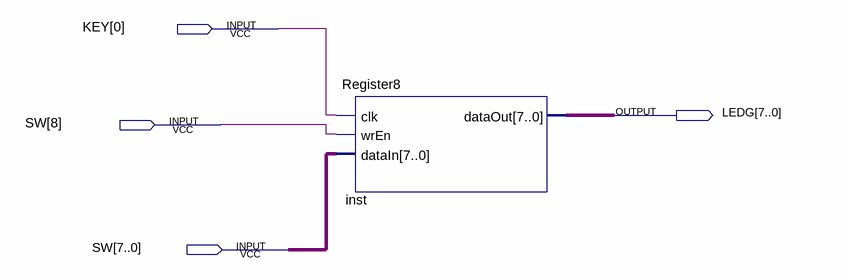
[diagram p0: schematic sheet]
// Quartus schematic Register_Demo.bdf as structural Verilog: 1 symbols, 4 pins
module Register_Demo (
  input  [0:0] KEY,
  input  [8:0] SW,
  output [7:0] LEDG
);

  Register8 inst (.clk(KEY[0]), .wrEn(SW[8]), .dataIn(SW[7:0]), .dataOut(LEDG));
endmodule
